# Altium schematic sheet P14_ETH2 RGMII.SchDoc
size 420 x 297 mm
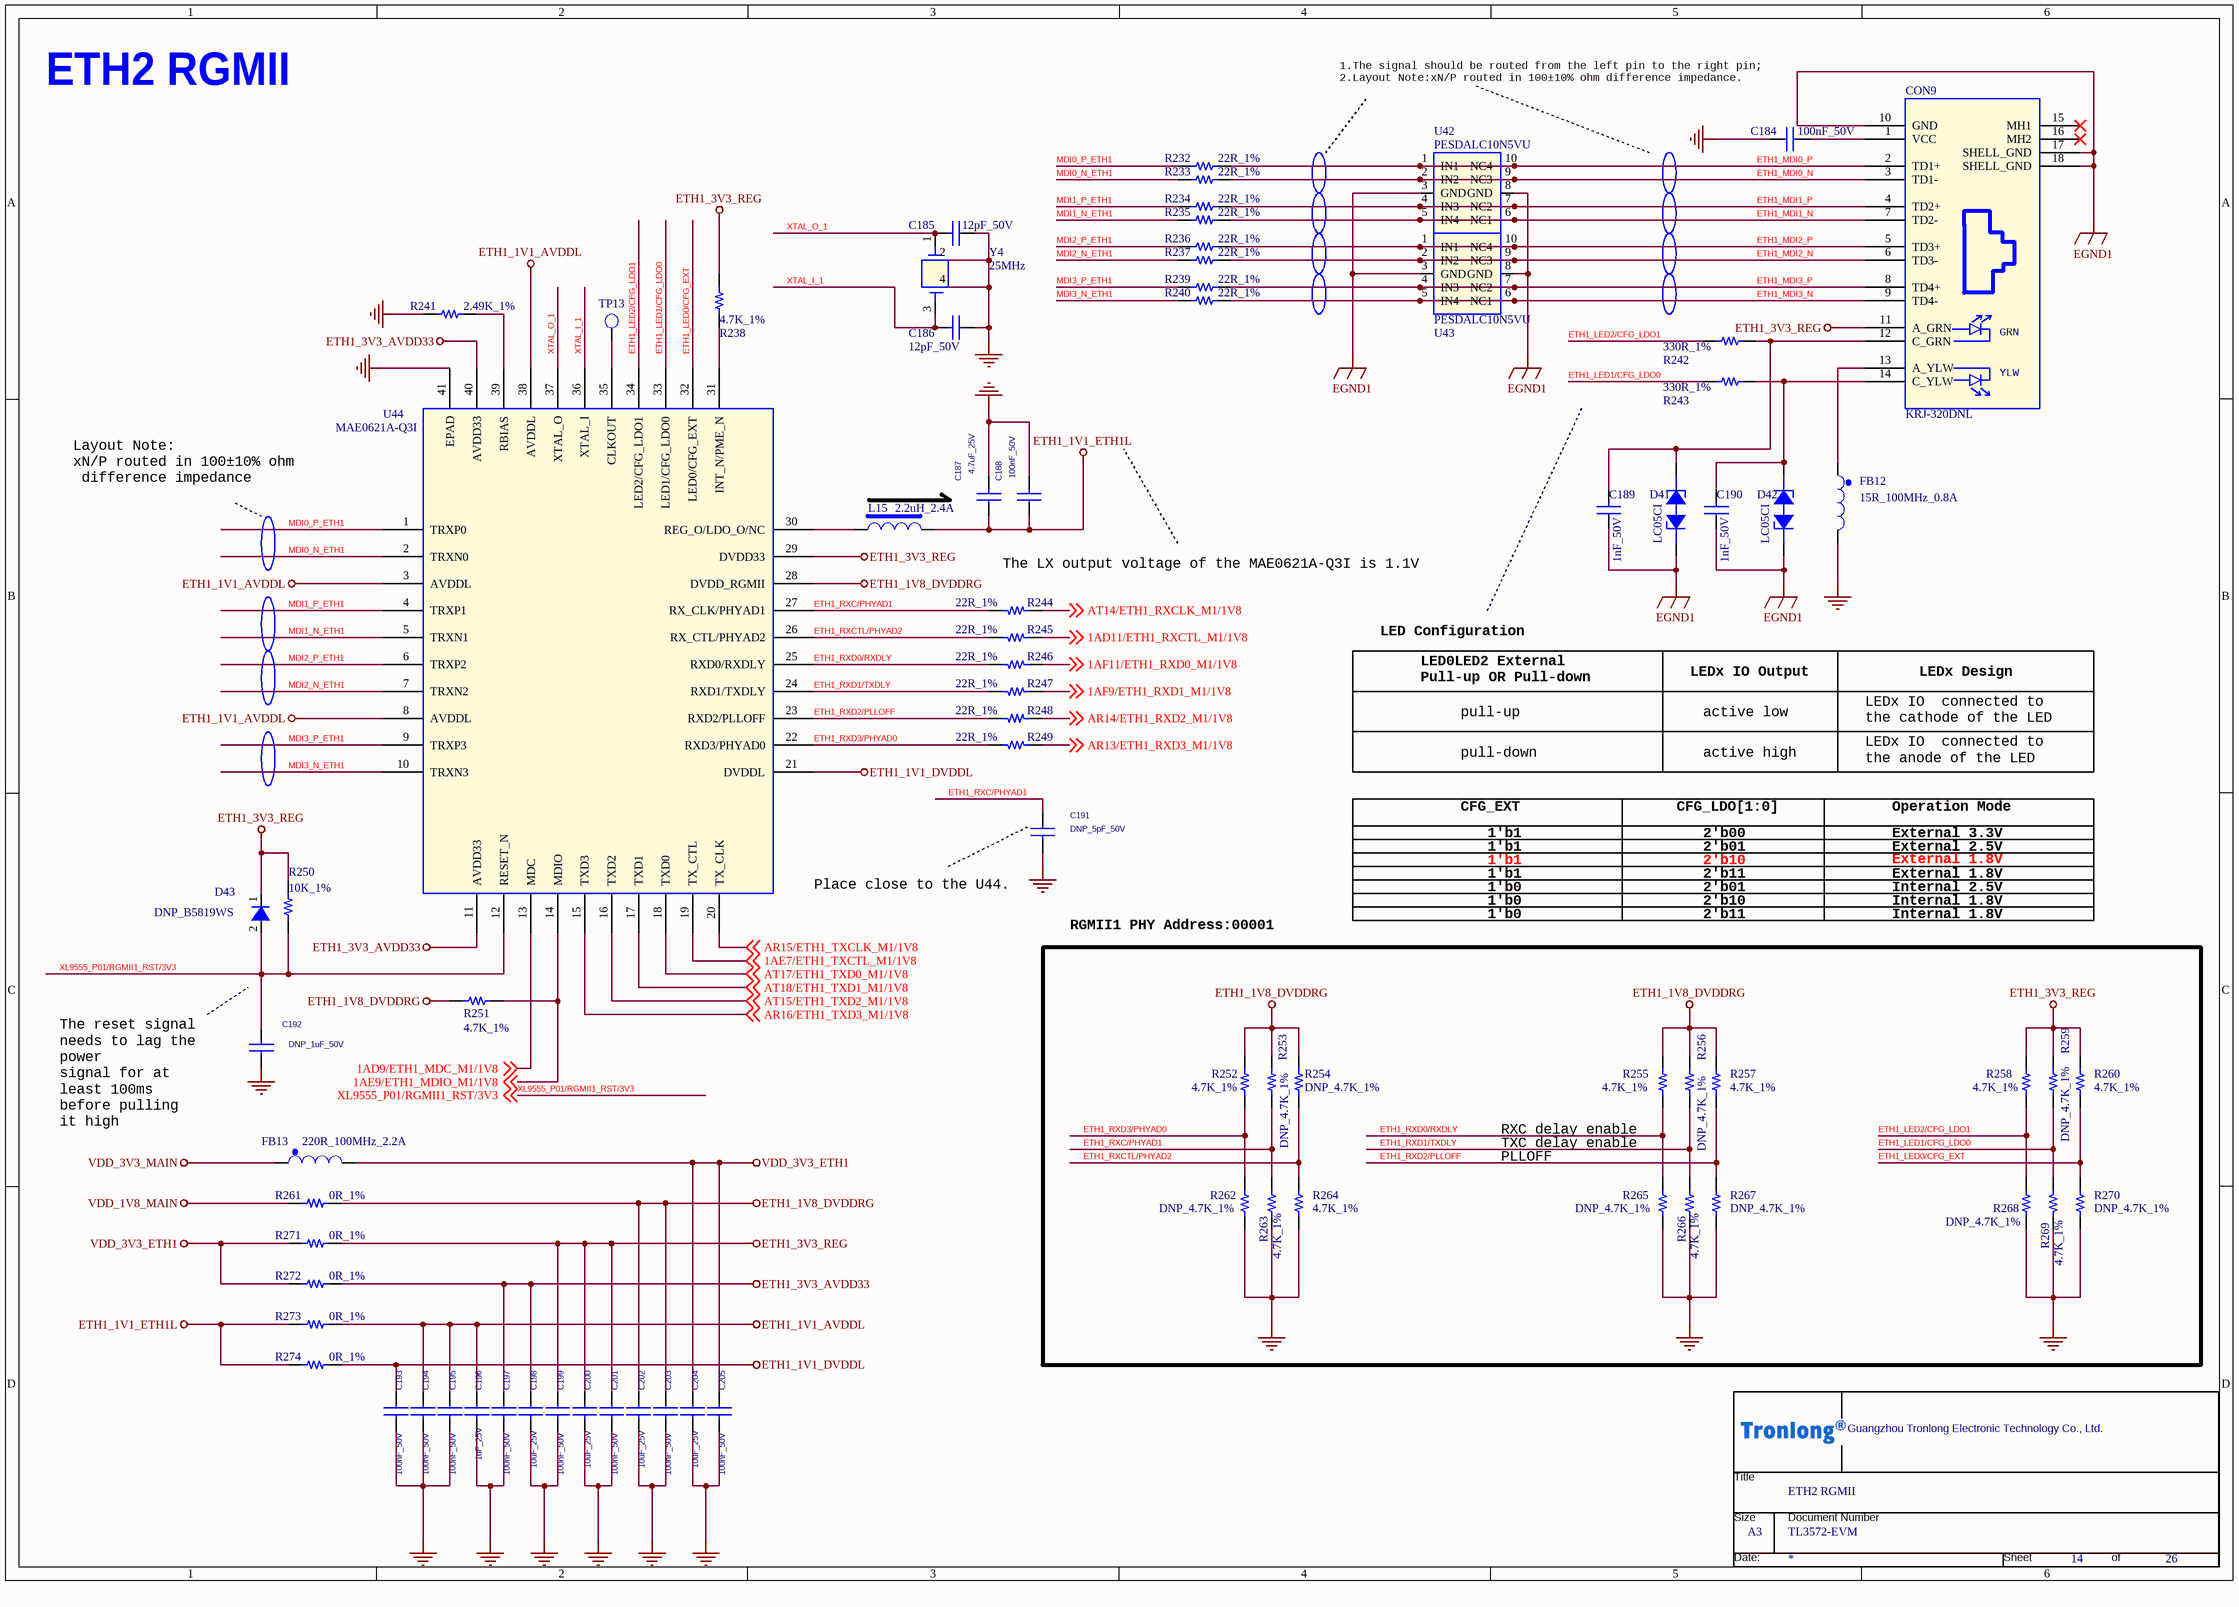
[diagram p0: P14_ETH2 RGMII.SchDoc]

## Parts
*  Doc: TL3572-EVM  Title: ETH2 RGMII  OrgName: Guangzhou Tronlong Electronic Technology Co., Ltd.  Page Size: A3  Page Number: 14  Page Count: 26  (hidden comment: Tronlong_TITTLE_20211115)  (graphical)
C184  100nF_50V  [C0402]
C185  12pF_50V  [C0402]
C186  12pF_50V  [C0402]
C187  4.7uF_25V  [C0603]
C188  100nF_50V  [C0402]
C189  1nF_50V  [C0402]
C190  1nF_50V  [C0402]
C191  DNP_5pF_50V  [C0402]
C192  DNP_1uF_50V  [C0603]
C193  100nF_50V  [C0402]
C194  100nF_50V  [C0402]
C195  100nF_50V  [C0402]
C196  1uF_25V  [C0402]
C197  100nF_50V  [C0402]
C198  10uF_25V  [C0603]
C199  100nF_50V  [C0402]
C200  10uF_25V  [C0603]
C201  100nF_50V  [C0402]
C202  10uF_25V  [C0603]
C203  100nF_50V  [C0402]
C204  10uF_25V  [C0603]
C205  100nF_50V  [C0402]
CON9  KRJ-320DNL  [KRJ-320DNL_14P]
D41  LC05CI  [SOD323]
D42  LC05CI  [SOD323]
D43  DNP_B5819WS  [SOD-323]
FB12  15R_100MHz_0.8A  [L0603]
FB13  220R_100MHz_2.2A  [L0603]
L15  2.2uH_2.4A  [SMD-L2520M-2P]
R232  22R_1%  [R0402]
R233  22R_1%  [R0402]
R234  22R_1%  [R0402]
R235  22R_1%  [R0402]
R236  22R_1%  [R0402]
R237  22R_1%  [R0402]
R238  4.7K_1%  [R0402]
R239  22R_1%  [R0402]
R240  22R_1%  [R0402]
R241  2.49K_1%  [R0603]
R242  330R_1%  [R0402]
R243  330R_1%  [R0402]
R244  22R_1%  [R0402]
R245  22R_1%  [R0402]
R246  22R_1%  [R0402]
R247  22R_1%  [R0402]
R248  22R_1%  [R0402]
R249  22R_1%  [R0402]
R250  10K_1%  [R0402]
R251  4.7K_1%  [R0402]
R252  4.7K_1%  [R0402]
R253  DNP_4.7K_1%  [R0402]
R254  DNP_4.7K_1%  [R0402]
R255  4.7K_1%  [R0402]
R256  DNP_4.7K_1%  [R0402]
R257  4.7K_1%  [R0402]
R258  4.7K_1%  [R0402]
R259  DNP_4.7K_1%  [R0402]
R260  4.7K_1%  [R0402]
R261  0R_1%  [R0603]
R262  DNP_4.7K_1%  [R0402]
R263  4.7K_1%  [R0402]
R264  4.7K_1%  [R0402]
R265  DNP_4.7K_1%  [R0402]
R266  4.7K_1%  [R0402]
R267  DNP_4.7K_1%  [R0402]
R268  DNP_4.7K_1%  [R0402]
R269  4.7K_1%  [R0402]
R270  DNP_4.7K_1%  [R0402]
R271  0R_1%  [R0603]
R272  0R_1%  [R0603]
R273  0R_1%  [R0603]
R274  0R_1%  [R0603]
TP13  SMT TP  [TP30]  (value not drawn)
U42  PESDALC10N5VU  [DFN-10-2510]
U43  PESDALC10N5VU  [DFN-10-2510]
U44  MAE0621A-Q3I  [QFN40_5x5]
Y4  25MHz  [SMD_3225]

## Nets
EGND1: C189.1 C190.1 CON9.10(GND) CON9.17(SHELL_GND) CON9.18(SHELL_GND) D41.1(ANODE1) D42.1(ANODE1) U42.3(GND) U42.8(GND) U43.3(GND) U43.8(GND)
ETH1_1V1_AVDDL: C194.1 C195.1 C196.1 R273.2 U44.3(AVDDL) U44.8(AVDDL) U44.38(AVDDL)
ETH1_1V1_DVDDL: C193.1 R274.2 U44.21(DVDDL)
ETH1_1V1_ETH1L: C187.1 C188.1 L15.2 R273.1 R274.1
ETH1_1V8_DVDDRG: C202.1 C203.1 R251.1 R252.2 R253.2 R254.2 R255.2 R256.2 R257.2 R261.2 U44.28(DVDD_RGMII)
ETH1_3V3_AVDD33: C197.1 C198.1 R272.2 U44.11(AVDD33) U44.40(AVDD33)
ETH1_3V3_REG: C199.1 C200.1 C201.1 CON9.11(A_GRN) D43.1(Cathode) R238.2 R250.2 R258.2 R259.2 R260.2 R271.2 U44.29(DVDD33)
GND: C184.1 C185.1 C186.1 C187.2 C188.2 C191.2 C192.2 C193.2 C194.2 C195.2 C196.2 C197.2 C198.2 C199.2 C200.2 C201.2 C202.2 C203.2 C204.2 C205.2 FB12.2 R241.2 R262.1 R263.1 R264.1 R265.1 R266.1 R267.1 R268.1 R269.1 R270.1 U44.41(EPAD) Y4.2 Y4.4
VDD_1V8_MAIN: R261.1
VDD_3V3_ETH1: C204.1 C205.1 FB13.2 R271.1 R272.1
VDD_3V3_MAIN: FB13.1
1AD9/ETH1_MDC_M1/1V8: U44.13(MDC) ; off-sheet 1AD9/ETH1_MDC_M1/1V8
1AD11/ETH1_RXCTL_M1/1V8: R245.1 ; off-sheet 1AD11/ETH1_RXCTL_M1/1V8
1AE7/ETH1_TXCTL_M1/1V8: U44.19(TX_CTL) ; off-sheet 1AE7/ETH1_TXCTL_M1/1V8
1AE9/ETH1_MDIO_M1/1V8: R251.2 U44.14(MDIO) ; off-sheet 1AE9/ETH1_MDIO_M1/1V8
1AF9/ETH1_RXD1_M1/1V8: R247.1 ; off-sheet 1AF9/ETH1_RXD1_M1/1V8
1AF11/ETH1_RXD0_M1/1V8: R246.1 ; off-sheet 1AF11/ETH1_RXD0_M1/1V8
AR13/ETH1_RXD3_M1/1V8: R249.1 ; off-sheet AR13/ETH1_RXD3_M1/1V8
AR14/ETH1_RXD2_M1/1V8: R248.1 ; off-sheet AR14/ETH1_RXD2_M1/1V8
AR15/ETH1_TXCLK_M1/1V8: U44.20(TX_CLK) ; off-sheet AR15/ETH1_TXCLK_M1/1V8
AR16/ETH1_TXD3_M1/1V8: U44.15(TXD3) ; off-sheet AR16/ETH1_TXD3_M1/1V8
AT14/ETH1_RXCLK_M1/1V8: R244.1 ; off-sheet AT14/ETH1_RXCLK_M1/1V8
AT15/ETH1_TXD2_M1/1V8: U44.16(TXD2) ; off-sheet AT15/ETH1_TXD2_M1/1V8
AT17/ETH1_TXD0_M1/1V8: U44.18(TXD0) ; off-sheet AT17/ETH1_TXD0_M1/1V8
AT18/ETH1_TXD1_M1/1V8: U44.17(TXD1) ; off-sheet AT18/ETH1_TXD1_M1/1V8
ETH1_LED0/CFG_EXT: R260.1 R270.2 U44.32(LED0/CFG_EXT)
ETH1_LED1/CFG_LDO0: R243.1 R259.1 R269.2 U44.33(LED1/CFG_LDO0)
ETH1_LED2/CFG_LDO1: R242.1 R258.1 R268.2 U44.34(LED2/CFG_LDO1)
ETH1_MDI0_N: CON9.3(TD1-) R233.2 U42.2(IN2) U42.9(NC3)
ETH1_MDI0_P: CON9.2(TD1+) R232.2 U42.1(IN1) U42.10(NC4)
ETH1_MDI1_N: CON9.7(TD2-) R235.2 U42.5(IN4) U42.6(NC1)
ETH1_MDI1_P: CON9.4(TD2+) R234.2 U42.4(IN3) U42.7(NC2)
ETH1_MDI2_N: CON9.6(TD3-) R237.2 U43.2(IN2) U43.9(NC3)
ETH1_MDI2_P: CON9.5(TD3+) R236.2 U43.1(IN1) U43.10(NC4)
ETH1_MDI3_N: CON9.9(TD4-) R240.2 U43.5(IN4) U43.6(NC1)
ETH1_MDI3_P: CON9.8(TD4+) R239.2 U43.4(IN3) U43.7(NC2)
ETH1_RXC/PHYAD1: C191.1 R244.2 R253.1 R263.2 U44.27(RX_CLK/PHYAD1)
ETH1_RXCTL/PHYAD2: R245.2 R254.1 R264.2 U44.26(RX_CTL/PHYAD2)
ETH1_RXD0/RXDLY: R246.2 R255.1 R265.2 U44.25(RXD0/RXDLY)
ETH1_RXD1/TXDLY: R247.2 R256.1 R266.2 U44.24(RXD1/TXDLY)
ETH1_RXD2/PLLOFF: R248.2 R257.1 R267.2 U44.23(RXD2/PLLOFF)
ETH1_RXD3/PHYAD0: R249.2 R252.1 R262.2 U44.22(RXD3/PHYAD0)
MDI0_N_ETH1: R233.1 U44.2(TRXN0)
MDI0_P_ETH1: R232.1 U44.1(TRXP0)
MDI1_N_ETH1: R235.1 U44.5(TRXN1)
MDI1_P_ETH1: R234.1 U44.4(TRXP1)
MDI2_N_ETH1: R237.1 U44.7(TRXN2)
MDI2_P_ETH1: R236.1 U44.6(TRXP2)
MDI3_N_ETH1: R240.1 U44.10(TRXN3)
MDI3_P_ETH1: R239.1 U44.9(TRXP3)
XL9555_P01/RGMII1_RST/3V3: C192.1 D43.2(Anode) R250.1 U44.12(RESET_N) ; off-sheet XL9555_P01/RGMII1_RST/3V3
XTAL_I_1: C186.2 U44.36(XTAL_I) Y4.3
XTAL_O_1: C185.2 U44.37(XTAL_O) Y4.1
NetC184_2: C184.2 CON9.1(VCC)
NetC189_2: C189.2 CON9.12(C_GRN) D41.2(CATHODE2) R242.2
NetC190_2: C190.2 CON9.14(C_YLW) D42.2(CATHODE2) R243.2
NetCON9_13: CON9.13(A_YLW) FB12.1
NetL15_1: L15.1 U44.30(REG_O/LDO_O/NC)
NetR238_1: R238.1 U44.31(INT_N/PME_N)
NetR241_1: R241.1 U44.39(RBIAS)
NetTP13_1: TP13.1(TP) U44.35(CLKOUT)

Not connected (* = marked no-connect by the designer): CON9 15(MH1)* 16(MH2)*

## Notes on the sheet
- ETH2 RGMII
- 1.The signal should be routed from the left pin to the right pin;
  2.Layout Note:xN/P routed in 100±10% ohm difference impedance.
- Layout Note:
  xN/P routed in 100±10% ohm
  difference impedance
- The LX output voltage of the MAE0621A-Q3I is 1.1V
- LED Configuration
- LED0LED2 External
  Pull-up OR Pull-down
- pull-up
- LEDx IO Output
- active low
- LEDx IO  connected to
  the cathode of the LED
- LEDx Design
- pull-down
- active high
- LEDx IO  connected to
  the anode of the LED
- CFG_EXT
- 1'b1
- CFG_LDO[1:0]
- 2'b00
- 2'b01
- 2'b10
- Operation Mode
- External 3.3V
- External 2.5V
- External 1.8V
- (near U44) Place close to the U44.
- RGMII1 PHY Address:00001
- 1'b0
- 2'b11
- Internal 2.5V
- Internal 1.8V
- (near C192) The reset signal
  needs to lag the
  power
  signal for at
  least 100ms
  before pulling
  it high
- RXC delay enable
- TXC delay enable
- PLLOFF
- (in symbol KRJ-320DNL_0) GRN; YLW
- (in symbol Tronlong_TITTLE_20211115) Title; Size; Document Number; Date:; Sheet; of

## Library data of the parts
* = Tronlong_TITTLE_20211115: RevCode: A?; Page Create Date: March  8, 1995; Page Modify Date: *
C184 = CAP NP_Dup2: 贴片陶瓷电容,100nF,10%,50V,X7R; Manufacturer Character: 中国大陆; Manufacturer PartNumber: 0402B104K500NT; Manufacturer: 广东风华高新科技股份有限公司（FH）; ERP Number: 005.0001.0001.00681; Operation Temperature（℃）: -55~+125(Ta); As-Welded: /; Eco-Label: ROHS; PCB Footprint: C0402; Part Status: 试用
C185 = CAP NP_Dup2: 贴片陶瓷电容,12pF,5%,50V,COG; Manufacturer: 广东风华高新科技股份有限公司（FH）; Manufacturer PartNumber: 0402CG120J500NT; Manufacturer Character: 中国大陆; Eco-Label: ROHS; Operation Temperature（℃）: -55~+125(Ta); As-Welded: /; ERP Number: 005.0001.0001.00612; PCB Footprint: C0402; Part Status: 试用
C186 = CAP NP_Dup2: 贴片陶瓷电容,12pF,5%,50V,COG; Manufacturer PartNumber: 0402CG120J500NT; Manufacturer: 广东风华高新科技股份有限公司（FH）; Manufacturer Character: 中国大陆; Eco-Label: ROHS; Operation Temperature（℃）: -55~+125(Ta); As-Welded: /; ERP Number: 005.0001.0001.00612; PCB Footprint: C0402; Part Status: 试用
C187 = CAP NP_Dup2: 贴片陶瓷电容,4.7uF,10%,25V,X5R; Manufacturer PartNumber: 0603X475K250NT; Manufacturer: 广东风华高新科技股份有限公司（FH）; Manufacturer Character: 中国大陆; Eco-Label: ROHS; As-Welded: /; Operation Temperature（℃）: -55~+85(Ta); ERP Number: 005.0001.0001.00566; PCB Footprint: C0603; Part Status: 优选
C188 = CAP NP_Dup2: 贴片陶瓷电容,100nF,10%,50V,X7R; Manufacturer Character: 中国大陆; Manufacturer: 广东风华高新科技股份有限公司（FH）; Manufacturer PartNumber: 0402B104K500NT; ERP Number: 005.0001.0001.00681; Operation Temperature（℃）: -55~+125(Ta); As-Welded: /; Eco-Label: ROHS; PCB Footprint: C0402; Part Status: 试用
C189 C190 = CAP NP_1: 贴片陶瓷电容,1nF,10%,50V,X7R; Manufacturer: 广东风华高新科技股份有限公司（FH）; Manufacturer PN: GRM033R61E102KA01; Manufacturer Character: 中国大陆; Manufacturer PartNumber: 0402B102K500NT; ERP Number: 005.0001.0001.00523; RK PN: 902003109; Priority: A; Operation Temperature（℃）: -55~+125(Ta); As-Welded: /; Eco-Label: ROHS; Part Type: 一般用片状陶瓷电容; Tolerance: ±10%; Created by: JJJ; Part Status: 优选
C191 = CAP NP_Dup2: 贴片陶瓷电容,22pF,5%,50V,COG; Manufacturer Character: 中国大陆; Manufacturer PartNumber: 0402CG220J500NT; Manufacturer: 广东风华高新科技股份有限公司（FH）; ERP Number: 005.0001.0001.00543; Operation Temperature（℃）: -55~+125(Ta); As-Welded: DNP; Eco-Label: EXEMPTION; PCB Footprint: C0402; Part Status: 优选
C192 = CAP NP_Dup2: 贴片陶瓷电容,1uF,10%,50V,X5R; Manufacturer Character: 中国大陆; Manufacturer PartNumber: 0603X105K500NT; Manufacturer: 广东风华高新科技股份有限公司（FH）; ERP Number: 005.0001.0001.00672; As-Welded: DNP; Operation Temperature（℃）: -55~+85(Ta); Eco-Label: ROHS; PCB Footprint: C0603; Part Status: 试用
C193 C195 C197 C199 C203 C205 = CAP NP_Dup2: 贴片陶瓷电容,100nF,10%,50V,X7R; Manufacturer: 广东风华高新科技股份有限公司（FH）; Manufacturer PartNumber: 0402B104K500NT; Manufacturer Character: 中国大陆; Eco-Label: ROHS; As-Welded: /; Operation Temperature（℃）: -55~+125(Ta); ERP Number: 005.0001.0001.00681; PCB Footprint: C0402; Part Status: 试用
C194 = CAP NP_Dup2: 贴片陶瓷电容,100nF,10%,50V,X7R; Manufacturer PartNumber: 0402B104K500NT; Manufacturer: 广东风华高新科技股份有限公司（FH）; Manufacturer Character: 中国大陆; ERP Number: 005.0001.0001.00681; Operation Temperature（℃）: -55~+125(Ta); As-Welded: /; Eco-Label: ROHS; PCB Footprint: C0402; Part Status: 试用
C196 = CAP NP_Dup2: 贴片陶瓷电容,1uF,10%,25V,X5R; Manufacturer: 广东风华高新科技股份有限公司（FH）; Manufacturer PartNumber: 0402X105K250NT; Manufacturer Character: 中国大陆; Eco-Label: ROHS; As-Welded: /; Operation Temperature（℃）: -55~+85(Ta); ERP Number: 005.0001.0001.00640; PCB Footprint: C0402; Part Status: 试用
C198 = CAP NP_Dup2: 贴片陶瓷电容,10uF,20%,25V,X5R; Manufacturer PartNumber: 0603X106M250NT; Manufacturer: 广东风华高新科技股份有限公司（FH）; Manufacturer Character: 中国大陆; ERP Number: 005.0001.0001.00527; As-Welded: /; Operation Temperature（℃）: -55~+85(Ta); Eco-Label: ROHS; PCB Footprint: C0603; Part Status: 优选
C200 C204 = CAP NP_Dup2: 贴片陶瓷电容,10uF,20%,25V,X5R; Manufacturer: 广东风华高新科技股份有限公司（FH）; Manufacturer PartNumber: 0603X106M250NT; Manufacturer Character: 中国大陆; ERP Number: 005.0001.0001.00527; As-Welded: /; Operation Temperature（℃）: -55~+85(Ta); Eco-Label: ROHS; PCB Footprint: C0603; Part Status: 优选
C201 = CAP NP_Dup2: 贴片陶瓷电容,100nF,10%,50V,X7R; Manufacturer PartNumber: 0402B104K500NT; Manufacturer: 广东风华高新科技股份有限公司（FH）; Manufacturer Character: 中国大陆; Eco-Label: ROHS; As-Welded: /; Operation Temperature（℃）: -55~+125(Ta); ERP Number: 005.0001.0001.00681; PCB Footprint: C0402; Part Status: 试用
C202 = CAP NP_Dup2: 贴片陶瓷电容,10uF,20%,25V,X5R; Manufacturer Character: 中国大陆; Manufacturer PartNumber: 0603X106M250NT; Manufacturer: 广东风华高新科技股份有限公司（FH）; ERP Number: 005.0001.0001.00527; Operation Temperature（℃）: -55~+85(Ta); As-Welded: /; Eco-Label: ROHS; PCB Footprint: C0603; Part Status: 优选
CON9 = KRJ-320DNL_0: RJ45连接器,14P,2.54mm间距,单层母座,90度,插件; Manufacturer: 东莞市科优达电子科技有限公司（DGKYD）; Manufacturer Character: 中国大陆; Eco-Label: ROHS; ERP Number: 005.0001.0003.00310; Operation Temperature（℃）: -40~+85(Ta); As-Welded: /; PCB Footprint: KRJ-320DNL_14P; Manufacturer PartNumber: KRJ-320DNL; Temperature: -40~85℃; Part Status: 优选
D41 = DIODE BREAKDOWN_2: TVS二极管,VRWM=5V,VBR=6V,一组,双向,30KV,30KV; Manufacturer Part Number: PESD3V3L1BA; Manufacturer: 上海雷卯电子科技有限公司（Leiditech）; Manufacturer Character: 中国大陆; Eco-Label: ROHS; As-Welded: /; Operation Temperature（℃）: -55~+125(Tj); room: KEY; ERP Number: 005.0001.0017.00060; PCB Footprint: SOD323; Temperature: -55~155℃; Manufacturer PartNumber: LC05CI; Part Status: 优选
D42 = DIODE BREAKDOWN_2: TVS二极管,VRWM=5V,VBR=6V,一组,双向,30KV,30KV; Manufacturer Character: 中国大陆; Manufacturer: 上海雷卯电子科技有限公司（Leiditech）; Manufacturer Part Number: PESD3V3L1BA; Eco-Label: ROHS; ERP Number: 005.0001.0017.00060; room: KEY; Operation Temperature（℃）: -55~+125(Tj); As-Welded: /; PCB Footprint: SOD323; Manufacturer PartNumber: LC05CI; Temperature: -55~155℃; Part Status: 优选
D43 = Diode200mA250V: 肖特基二极管,VR=40V,IF=1A,VF=0.6V@1A; TIIntPartnumber: 1E0013; MfrNum: MMSD103T1G; Mfr: On Semiconductor; Manufacturer Character: 中国大陆; Manufacturer: 江苏长晶科技股份有限公司（JSCJ）; DescriptiveText: Diode 200mA 250V 1.25V Forward Drop; PCB Footprint: smd123; Cost10K: 0.07; Cost100: 0.23; Vendor: Digikey; ERP Number: 005.0001.0010.00093; As-Welded: DNP; Operation Temperature（℃）: -55~+125(Tj); Eco-Label: ROHS; PartName: Diode200mA250V; Descriptive_Text: Diode 200mA 250V 1.25V Forward Drop; Temperature: -55~150; Manufacturer PartNumber: B5819WS; Part Status: 优选
FB12 = FB_0: 磁珠,100mΩ,0.8A,15R@100MHz; Manufacturer: 广东风华高新科技股份有限公司(FH); Manufacturer PartNumber: CBG160808U150T; Manufacturer Character: 中国大陆; Eco-Label: ROHS; ERP Number: 005.0001.0007.00013; As-Welded: /; Operation Temperature（℃）: -40~+85(Ta); PCB Footprint: L0603; Part Status: 试用; Temperature: -40~85℃
FB13 = FERRITE BEAD_Dup1: 磁珠,50mΩ,2.2A,220R@100MHz; Manufacturer Character: 中国大陆; Manufacturer PartNumber: UPZ1608U221-2R2TF; Manufacturer: 深圳顺络电子股份有限公司（Sunlord）; ERP Number: 005.0001.0007.00015; Operation Temperature（℃）: -55~+125(Ta); As-Welded: /; Eco-Label: ROHS; PCB Footprint: L0603; Part Status: 限选; Temperature: -55~125℃
L15 = INDUCTOR: 贴片功率电感,2.2uH,0.096Ω,Isat=2.9A,Irms=2.4A; Manufacturer: 深圳顺络电子股份有限公司(Sunlord); Manufacturer PartNumber: WPN252010U2R2MT; Manufacturer Character: 中国大陆; Parameter: L2520，奇力新一体成型电感，最大额定电流3A，内阻65毫欧，20%; Eco-Label: ROHS; Operation Temperature（℃）: -40~+125(Ta); As-Welded: /; ERP Number: 005.0001.0006.00132; PCB Footprint: SMD-L2520M-2P; Temperature: -40~125; Part Status: 试用
R232-R237 R239 R240 = Resistor_Dup1: 贴片电阻,22R,±1%,1/16W; Manufacturer Character: 中国大陆; Manufacturer PN: RC0402JR-0722RL; Manufacturer: 广东风华高新科技股份有限公司（FH）; Manufacturer PartNumber: RC-02K22R0FT; CLASS: DISCRETE; Eco-Label: ROHS; As-Welded: /; Operation Temperature（℃）: -55~+125(Ta); Tolerance: 5%; Priority: A; RK PN: 901001505; ERP Number: 005.0001.0002.01316; PCB Footprint: R0402; Created by: YTL; Wattage: 1/16W; Part Type: 通用厚膜电阻; Part Status: 试用
R238 = Resistor_Dup3: 贴片电阻,4.7K,±1%,1/16W; Manufacturer PartNumber: RC-02K4701FT; Manufacturer: 广东风华高新科技股份有限公司（FH）; Manufacturer Character: 中国大陆; CLASS: DISCRETE; ERP Number: 005.0001.0002.01359; As-Welded: /; Operation Temperature（℃）: -55~+125(Ta); Eco-Label: ROHS; PCB Footprint: R0402; Part Status: 试用
R241 = Resistor_Dup3: 贴片电阻,2.49K,±1%,1/10W; Manufacturer Character: 中国大陆; Manufacturer: 广东风华高新科技股份有限公司（FH）; Manufacturer PartNumber: RS-03K2491FT; CLASS: DISCRETE; ERP Number: 005.0001.0002.00969; Operation Temperature（℃）: -55~+155(Ta); As-Welded: /; Eco-Label: ROHS; PCB Footprint: R0603; Part Status: 优选
R242 = Resistor_Dup3: RC0402FR-07330RL,0402WGF3300TCE; Manufacturer PartNumber: 330R,±1%,R0402,≥1/16W; Manufacturer: 广州创龙; CLASS: DISCRETE; ERP Number: 005.0001.0023.00144; Operation Temperature（℃）: -40~+85(Ta); As-Welded: /; Eco-Label: ROHS; PCB Footprint: R0402; Manufacturer Character: -; Part Status: -
R243 = Resistor_Dup3: RC0402FR-07330RL,0402WGF3300TCE; Manufacturer: 广州创龙; Manufacturer PartNumber: 330R,±1%,R0402,≥1/16W; CLASS: DISCRETE; Eco-Label: ROHS; As-Welded: /; Operation Temperature（℃）: -40~+85(Ta); ERP Number: 005.0001.0023.00144; PCB Footprint: R0402; Part Status: -; Manufacturer Character: -
R244 R249 = Resistor_Dup3: 贴片电阻,22R,±1%,1/16W; Manufacturer Character: 中国大陆; Manufacturer PartNumber: RC-02K22R0FT; Manufacturer: 广东风华高新科技股份有限公司（FH）; CLASS: DISCRETE; ERP Number: 005.0001.0002.01316; As-Welded: /; Operation Temperature（℃）: -55~+125(Ta); room: RS232; Eco-Label: ROHS; PCB Footprint: R0402; Part Status: 试用
R245 R246 R248 = Resistor_Dup3: 贴片电阻,22R,±1%,1/16W; Manufacturer: 广东风华高新科技股份有限公司（FH）; Manufacturer PartNumber: RC-02K22R0FT; Manufacturer Character: 中国大陆; CLASS: DISCRETE; ERP Number: 005.0001.0002.01316; As-Welded: /; Operation Temperature（℃）: -55~+125(Ta); room: RS232; Eco-Label: ROHS; PCB Footprint: R0402; Part Status: 试用
R247 = Resistor_Dup3: 贴片电阻,22R,±1%,1/16W; Manufacturer: 广东风华高新科技股份有限公司（FH）; Manufacturer PartNumber: RC-02K22R0FT; Manufacturer Character: 中国大陆; CLASS: DISCRETE; Eco-Label: ROHS; room: RS232; Operation Temperature（℃）: -55~+125(Ta); As-Welded: /; ERP Number: 005.0001.0002.01316; PCB Footprint: R0402; Part Status: 试用
R250 = Resistor_Dup3: 贴片电阻,10K,±1%,1/16W; Manufacturer PartNumber: RC-02K1002FT; Manufacturer: 广东风华高新科技股份有限公司（FH）; Manufacturer Character: 中国大陆; CLASS: DISCRETE; Eco-Label: ROHS; Operation Temperature（℃）: -55~+125(Ta); As-Welded: /; ERP Number: 005.0001.0002.01326; PCB Footprint: R0402; Part Status: 优选
R251 = Resistor_Dup3: 贴片电阻,4.7K,±1%,1/16W; Manufacturer PartNumber: RC-02K4701FT; Manufacturer: 广东风华高新科技股份有限公司（FH）; Manufacturer Character: 中国大陆; CLASS: DISCRETE; Eco-Label: ROHS; Operation Temperature（℃）: -55~+125(Ta); As-Welded: /; ERP Number: 005.0001.0002.01359; PCB Footprint: R0402; Part Status: 试用
R252 R263 = Resistor_Dup3: 贴片电阻,4.7K,±1%,1/16W; Manufacturer PartNumber: RC-02K4701FT; Manufacturer: 广东风华高新科技股份有限公司（FH）; Manufacturer Character: 中国大陆; CLASS: DISCRETE; Eco-Label: ROHS; As-Welded: /; Operation Temperature（℃）: -55~+125(Ta); ERP Number: 005.0001.0002.01359; PCB Footprint: R0402; Part Status: 试用
R253 R265 = Resistor_Dup3: RC0402FR-074K7L,0402WGF4701TCE; Manufacturer: 广州创龙; Manufacturer PartNumber: 4.7K,±1%,R0402,≥1/16W; CLASS: DISCRETE; ERP Number: 005.0001.0023.00160; Operation Temperature（℃）: -40~+85(Ta); As-Welded: DNP; Eco-Label: ROHS; PCB Footprint: R0402; Manufacturer Character: -; Part Status: -
R254 = Resistor_Dup3: RC0402FR-074K7L,0402WGF4701TCE; Manufacturer PartNumber: 4.7K,±1%,R0402,≥1/16W; Manufacturer: 广州创龙; CLASS: DISCRETE; Eco-Label: ROHS; As-Welded: DNP; Operation Temperature（℃）: -40~+85(Ta); ERP Number: 005.0001.0023.00160; PCB Footprint: R0402; Manufacturer Character: -; Part Status: -
R255 = Resistor_Dup3: 贴片电阻,4.7K,±1%,1/16W; Manufacturer Character: 中国大陆; Manufacturer PartNumber: RC-02K4701FT; Manufacturer: 广东风华高新科技股份有限公司（FH）; CLASS: DISCRETE; ERP Number: 005.0001.0002.01359; As-Welded: /; Operation Temperature（℃）: -55~+125(Ta); Eco-Label: ROHS; PCB Footprint: R0402; Part Status: 试用
R256 R259 R262 R268 R270 = Resistor_Dup3: RC0402FR-074K7L,0402WGF4701TCE; Manufacturer PartNumber: 4.7K,±1%,R0402,≥1/16W; Manufacturer: 广州创龙; CLASS: DISCRETE; ERP Number: 005.0001.0023.00160; Operation Temperature（℃）: -40~+85(Ta); As-Welded: DNP; Eco-Label: ROHS; PCB Footprint: R0402; Part Status: -; Manufacturer Character: -
R257 R260 R264 = Resistor_Dup3: 贴片电阻,4.7K,±1%,1/16W; Manufacturer Character: 中国大陆; Manufacturer: 广东风华高新科技股份有限公司（FH）; Manufacturer PartNumber: RC-02K4701FT; CLASS: DISCRETE; Eco-Label: ROHS; As-Welded: /; Operation Temperature（℃）: -55~+125(Ta); ERP Number: 005.0001.0002.01359; PCB Footprint: R0402; Part Status: 试用
R258 R266 = Resistor_Dup3: 贴片电阻,4.7K,±1%,1/16W; Manufacturer: 广东风华高新科技股份有限公司（FH）; Manufacturer PartNumber: RC-02K4701FT; Manufacturer Character: 中国大陆; CLASS: DISCRETE; ERP Number: 005.0001.0002.01359; As-Welded: /; Operation Temperature（℃）: -55~+125(Ta); Eco-Label: ROHS; PCB Footprint: R0402; Part Status: 试用
R261 R273 = Resistor_Dup3: 贴片电阻,0R,±1%,1/10W; Manufacturer Character: 中国大陆; Manufacturer PartNumber: RS-03000FT; Manufacturer: 广东风华高新科技股份有限公司（FH）; CLASS: DISCRETE; ERP Number: 005.0001.0002.00956; Operation Temperature（℃）: -55~+155(Ta); room: RS232; As-Welded: /; Eco-Label: ROHS; PCB Footprint: R0603; Part Status: 优选
R267 = Resistor_Dup3: RC0402FR-074K7L,0402WGF4701TCE; Manufacturer: 广州创龙; Manufacturer PartNumber: 4.7K,±1%,R0402,≥1/16W; CLASS: DISCRETE; Eco-Label: ROHS; Operation Temperature（℃）: -40~+85(Ta); As-Welded: DNP; ERP Number: 005.0001.0023.00160; PCB Footprint: R0402; Part Status: -; Manufacturer Character: -
R269 = Resistor_Dup3: 贴片电阻,4.7K,±1%,1/16W; Manufacturer Character: 中国大陆; Manufacturer PartNumber: RC-02K4701FT; Manufacturer: 广东风华高新科技股份有限公司（FH）; CLASS: DISCRETE; Eco-Label: ROHS; Operation Temperature（℃）: -55~+125(Ta); As-Welded: /; ERP Number: 005.0001.0002.01359; PCB Footprint: R0402; Part Status: 试用
R271 R272 R274 = Resistor_Dup3: 贴片电阻,0R,±1%,1/10W; Manufacturer: 广东风华高新科技股份有限公司（FH）; Manufacturer PartNumber: RS-03000FT; Manufacturer Character: 中国大陆; CLASS: DISCRETE; Eco-Label: ROHS; As-Welded: /; room: RS232; Operation Temperature（℃）: -55~+155(Ta); ERP Number: 005.0001.0002.00956; PCB Footprint: R0603; Part Status: 优选
TP13 = T POINT R: /; Manufacturer Character: 中国大陆; CLASS: IC; As-Welded: DNP; PCB Footprint: TP30; Manufacturer: /; HEIGHT: 0.1MM; Operation Temperature（℃）: /; Manufacturer PartNumber: /
U42 = SU099PGTR: ESD二极管,VRWM=5V,VBR=6V,四组,单向,15KV,30KV; Manufacturer: 上海芯导电子科技股份有限公司（Prisemi）; Manufacturer Character: 中国大陆; Eco-Label: ROHS; As-Welded: /; Operation Temperature（℃）: -55~+150(Tj); ERP Number: 005.0001.0004.00739; PCB Footprint: DFN-10-2510; Temperature: -55~150; Manufacturer PartNumber: PESDALC10N5VU; Part Status: 优选
U43 = SU099PGTR: ESD二极管,VRWM=5V,VBR=6V,四组,单向,15KV,30KV; Manufacturer Character: 中国大陆; Manufacturer: 上海芯导电子科技股份有限公司（Prisemi）; Eco-Label: ROHS; As-Welded: /; Operation Temperature（℃）: -55~+150(Tj); ERP Number: 005.0001.0004.00739; PCB Footprint: DFN-10-2510; Temperature: -55~150; Manufacturer PartNumber: PESDALC10N5VU; Part Status: 优选
U44 = YT8531H-CA: 以太网收发器，RGMII/GMII/MII; Manufacturer: 联芸科技（杭州）股份有限公司; Manufacturer Character: 中国大陆; Operation Temperature（℃）: -40~+85(Ta); As-Welded: /; ERP Number: 005.0001.0004.01249; Eco-Label: ROHS; PCB Footprint: QFN40_5x5; Part Status: 优选; Manufacturer PartNumber: MAE0621A-Q3I
Y4 = CRYSTAL-4 PIN: 四脚无源晶振,25MHz,±10ppm,12pF,30Ω,±30ppm; Manufacturer Character: 中国大陆; Manufacturer PartNumber: S3B25.000F1210F30; Manufacturer: 深圳市星通时频电子有限公司（SCTF）; ERP Number: 005.0001.0005.00124; As-Welded: /; Operation Temperature（℃）: -40~+85(Ta); Eco-Label: ROHS; PCB Footprint: SMD_3225; Temperature: -40~85; Part Status: 试用